# Altium schematic sheet FrontSense.SchDoc
size A4; SheetNumber: 2; SheetTotal: 6
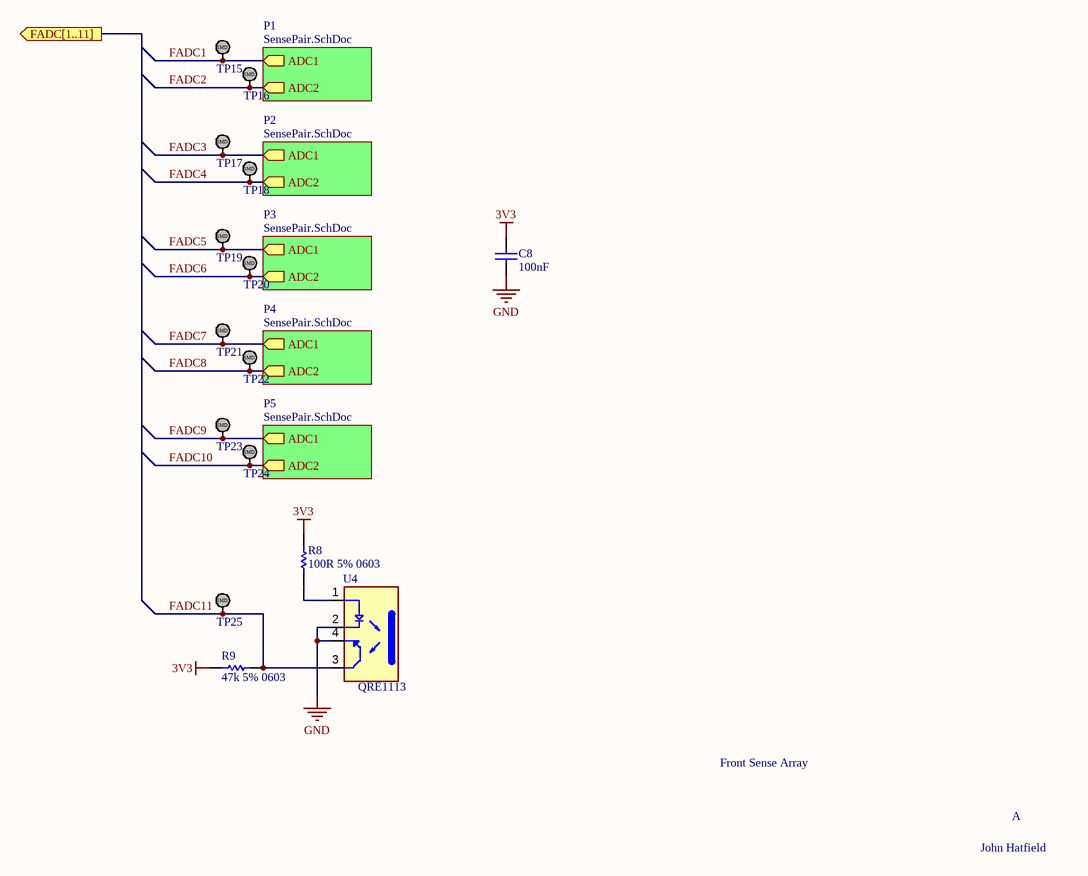
[diagram p0: FrontSense.SchDoc]

## Parts
C8  100nF  [Cap_Ceramic_0603]
R8  100R 5% 0603  [Res_ThinFilm_0603]
R9  47k 5% 0603  [Res_ThinFilm_0603]
TP15  TestPoint_SMD  [TestPointSMD]  (value not drawn)
TP16  TestPoint_SMD  [TestPointSMD]  (value not drawn)
TP17  TestPoint_SMD  [TestPointSMD]  (value not drawn)
TP18  TestPoint_SMD  [TestPointSMD]  (value not drawn)
TP19  TestPoint_SMD  [TestPointSMD]  (value not drawn)
TP20  TestPoint_SMD  [TestPointSMD]  (value not drawn)
TP21  TestPoint_SMD  [TestPointSMD]  (value not drawn)
TP22  TestPoint_SMD  [TestPointSMD]  (value not drawn)
TP23  TestPoint_SMD  [TestPointSMD]  (value not drawn)
TP24  TestPoint_SMD  [TestPointSMD]  (value not drawn)
TP25  TestPoint_SMD  [TestPointSMD]  (value not drawn)
U4  QRE1113  [DIP400W50P180L360H200Q4]

## Sub-sheets
P1 = SensePair.SchDoc: ADC1 (out), ADC2 (out)
P2 = SensePair.SchDoc: ADC1 (out), ADC2 (out)
P3 = SensePair.SchDoc: ADC1 (out), ADC2 (out)
P4 = SensePair.SchDoc: ADC1 (out), ADC2 (out)
P5 = SensePair.SchDoc: ADC1 (out), ADC2 (out)

## Ports
FADC[1..11] (out)

## Nets
3V3: C8.2 R8.2 R9.1
GND: C8.1 U4.2(C) U4.4(ET)
FADC1: TP15.1 ; sheet P1/ADC1
FADC2: TP16.1 ; sheet P1/ADC2
FADC3: TP17.1 ; sheet P2/ADC1
FADC4: TP18.1 ; sheet P2/ADC2
FADC5: TP19.1 ; sheet P3/ADC1
FADC6: TP20.1 ; sheet P3/ADC2
FADC7: TP21.1 ; sheet P4/ADC1
FADC8: TP22.1 ; sheet P4/ADC2
FADC9: TP23.1 ; sheet P5/ADC1
FADC10: TP24.1 ; sheet P5/ADC2
FADC11: R9.2 TP25.1 U4.3(CT)
NetR8_1: R8.1 U4.1(A)

## Notes on the sheet
- Front Sense Array
- A
- John Hatfield
- THIS DOCUMENT AND THE DATA DISCLOSED HEREIN OR
- HEREWITH IS THE PROPERTY OF ALTIUM LIMITED AND MAY
- DWG NO:
- REVISION
- REV:
- DESCRIPTION
- DATE
- APPROVED
- BE FREELY DISTRIBUTED IN WHOLE. NO RIGHTS ARE
- RESERVED OR EXPRESS OR IMPLIED WARANTEE GIVEN.
- ENG:
- APPROVALS
- PROJECT
- DSN:
- CHK:
- REFERENCE DOCUMENTS
- PROJECT REVISION:
- TITLE
- DOCUMENT REVISION:
- DESIGN ITEM:
- BOM:
- FAB DWG:
- PCB DWG:
- ASSY DWG:
- SCALE:
- A3
- SIZE
- CAGE CODE
- FILE NAME
- DWG NO.
- SHEET
- OF
- REV
- (in symbol TestPoint_SMD) SMD

## Library data of the parts
C8 = 100nF 50V 5% X7R 0603: Capacitor, Ceramic, SMD, 100nF, 50V, 5%, X7R, 0603
R8 = 100R 5%, 0603: Resistor, SMD, 100R, 0.1W, 5%, 0603
R9 = 47k 5% 0603: Resistor, SMD, 47k, 0.1W, 5%, 0603
U4 = QRE1113: Reflective Optical Sensor 0.197 _5mm_ 4-DIP _0.157, 4.00mm_; MF: ON Semiconductor; Availability: Unavailable; Package: DIP-4 ON Semiconductor; MP: QRE1113; Value: *; SnapEDA_Link: https://www.snapeda.com/parts/QRE1113/ON%20Semiconductor/view-part/2391104/?ref=snap; Price: None